# EAGLE design Iridium_Mini_Radio_Beacon (EAGLE 9.4.1)

## Sheet 1 of 5
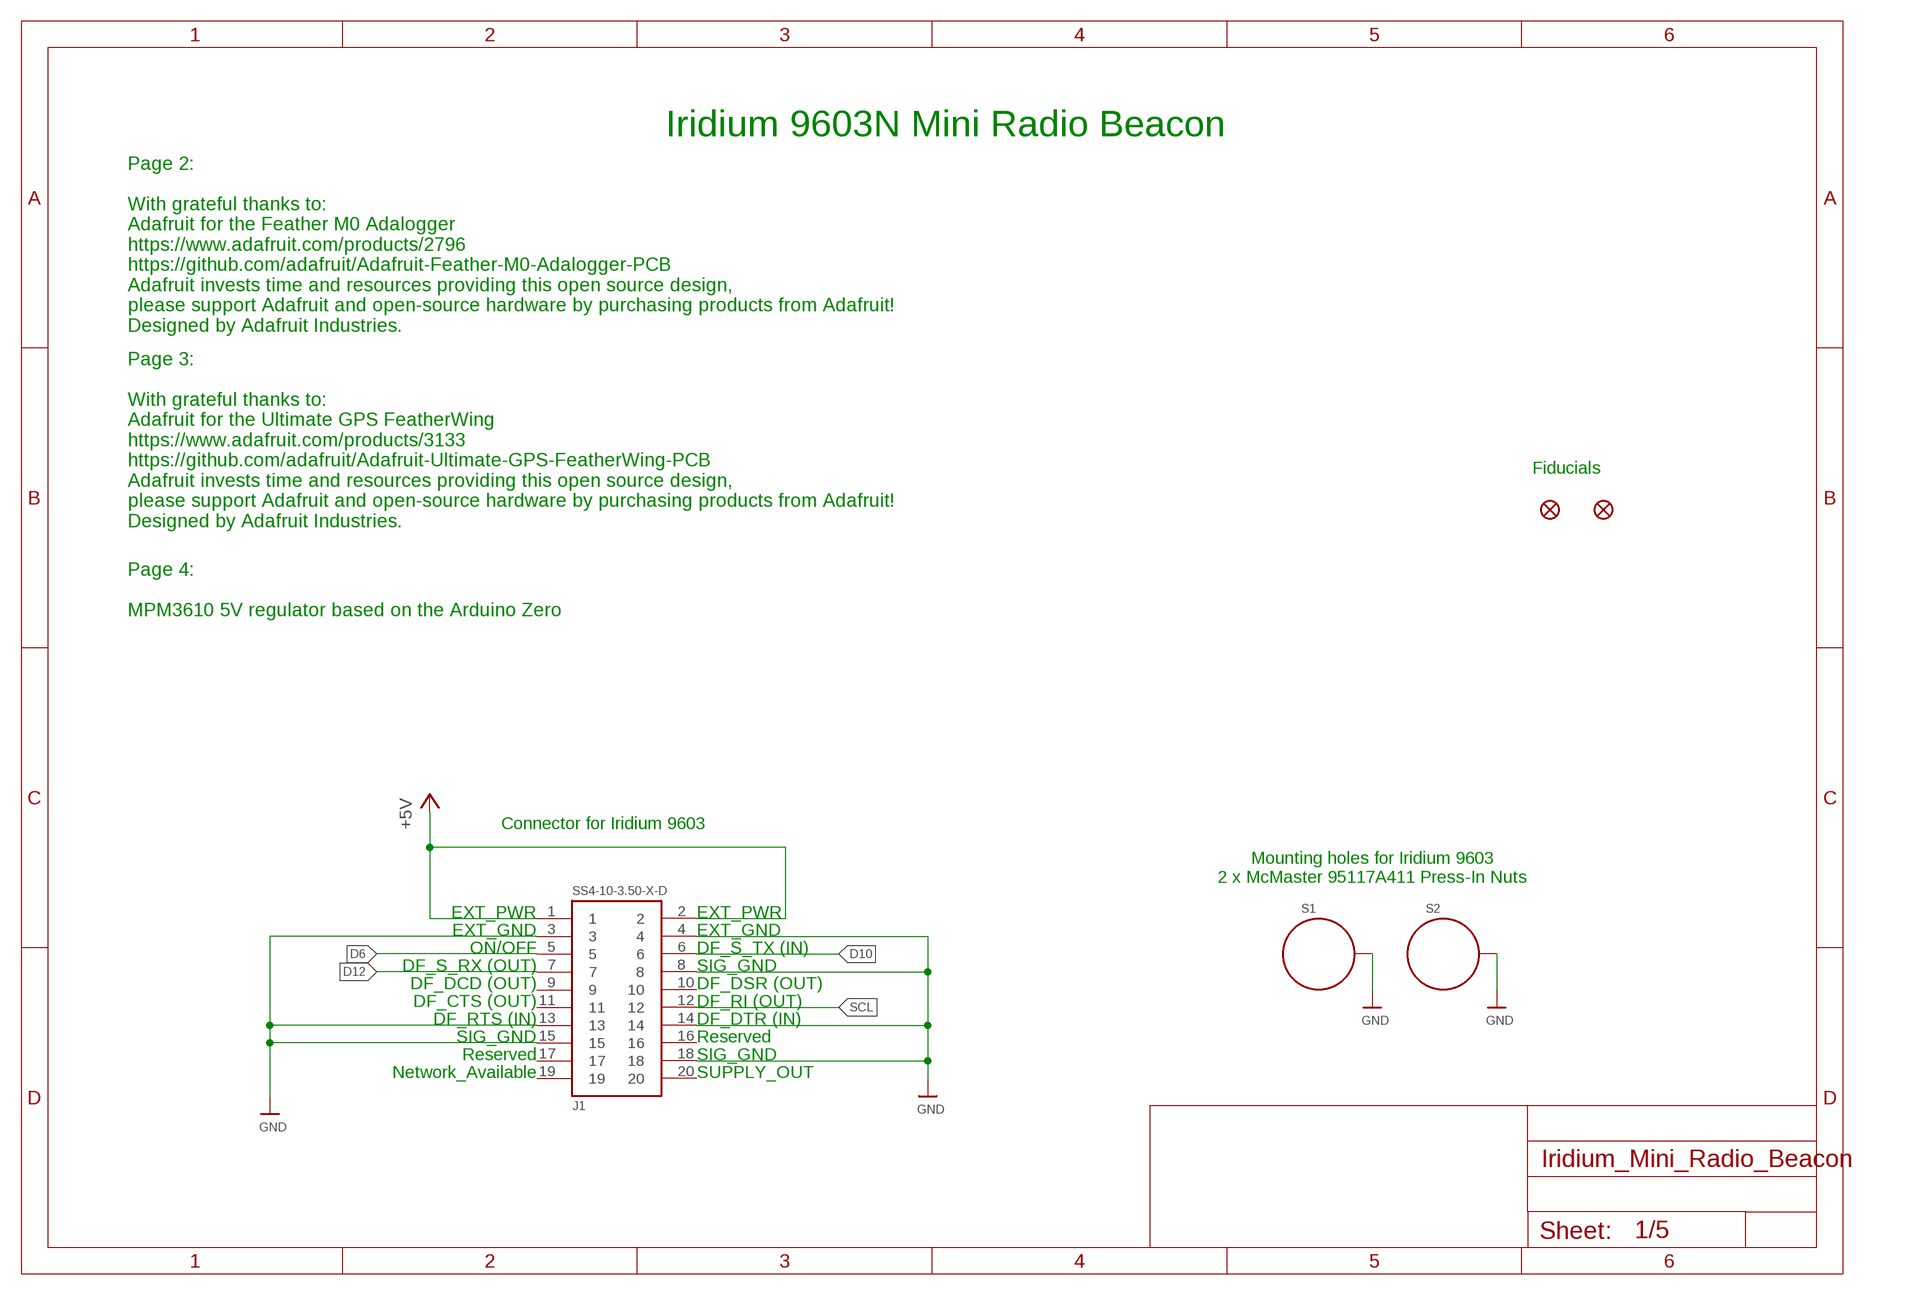
[diagram p0: schematic, sheet 1]

### Parts
FD1  FIDUCIAL1X2  [FIDUCIAL-1X2]
FD2  FIDUCIAL1X2  [FIDUCIAL-1X2]
J1  SS4-10-3.50-X-D  [SS4-10-3.50-X-D]
S1  STANDOFF_ELECTRICALMCMASTER-95117A411  [STANDOFF-ELECTRICAL-MCMASTER-95117A411]
S2  STANDOFF_ELECTRICALMCMASTER-95117A411  [STANDOFF-ELECTRICAL-MCMASTER-95117A411]

### Nets
+5V: J1.1 J1.2 ; also sheet 3,4
D6: J1.5 ; also sheet 2
D10: J1.6 ; also sheet 2
D12: J1.7 ; also sheet 2
GND: J1.3 J1.4 J1.8 J1.13 J1.14 J1.15 J1.18 S1.P1 S2.P1 ; also sheet 2,3,4,5
SCL: J1.12 ; also sheet 2
Unconnected: J1.9 J1.10 J1.11 J1.16 J1.17 J1.19 J1.20

### Notes on the sheet
- Iridium 9603N Mini Radio Beacon
- Page 2:
  
  With grateful thanks to:
  Adafruit for the Feather M0 Adalogger
  https://www.adafruit.com/products/2796
  https://github.com/adafruit/Adafruit-Feather-M0-Adalogger-PCB
  Adafruit invests time and resources providing this open source design,
  please support Adafruit and open-source hardware by purchasing products from Adafruit!
  Designed by Adafruit Industries.
- Fiducials
- Page 3:
  
  With grateful thanks to:
  Adafruit for the Ultimate GPS FeatherWing
  https://www.adafruit.com/products/3133
  https://github.com/adafruit/Adafruit-Ultimate-GPS-FeatherWing-PCB
  Adafruit invests time and resources providing this open source design,
  please support Adafruit and open-source hardware by purchasing products from Adafruit!
  Designed by Adafruit Industries.
- Page 4:
  
  MPM3610 5V regulator based on the Arduino Zero
- Connector for Iridium 9603
- Mounting holes for Iridium 9603
  2 x McMaster 95117A411 Press-In Nuts
- EXT_PWR | EXT_PWR
- EXT_GND | EXT_GND
- ON/OFF | DF_S_TX (IN)
- DF_S_RX (OUT) | SIG_GND
- DF_DCD (OUT) | DF_DSR (OUT)
- DF_CTS (OUT) | DF_RI (OUT)
- DF_RTS (IN) | DF_DTR (IN)
- SIG_GND | Reserved
- Reserved | SIG_GND
- Network_Available | SUPPLY_OUT

## Sheet 2 of 5
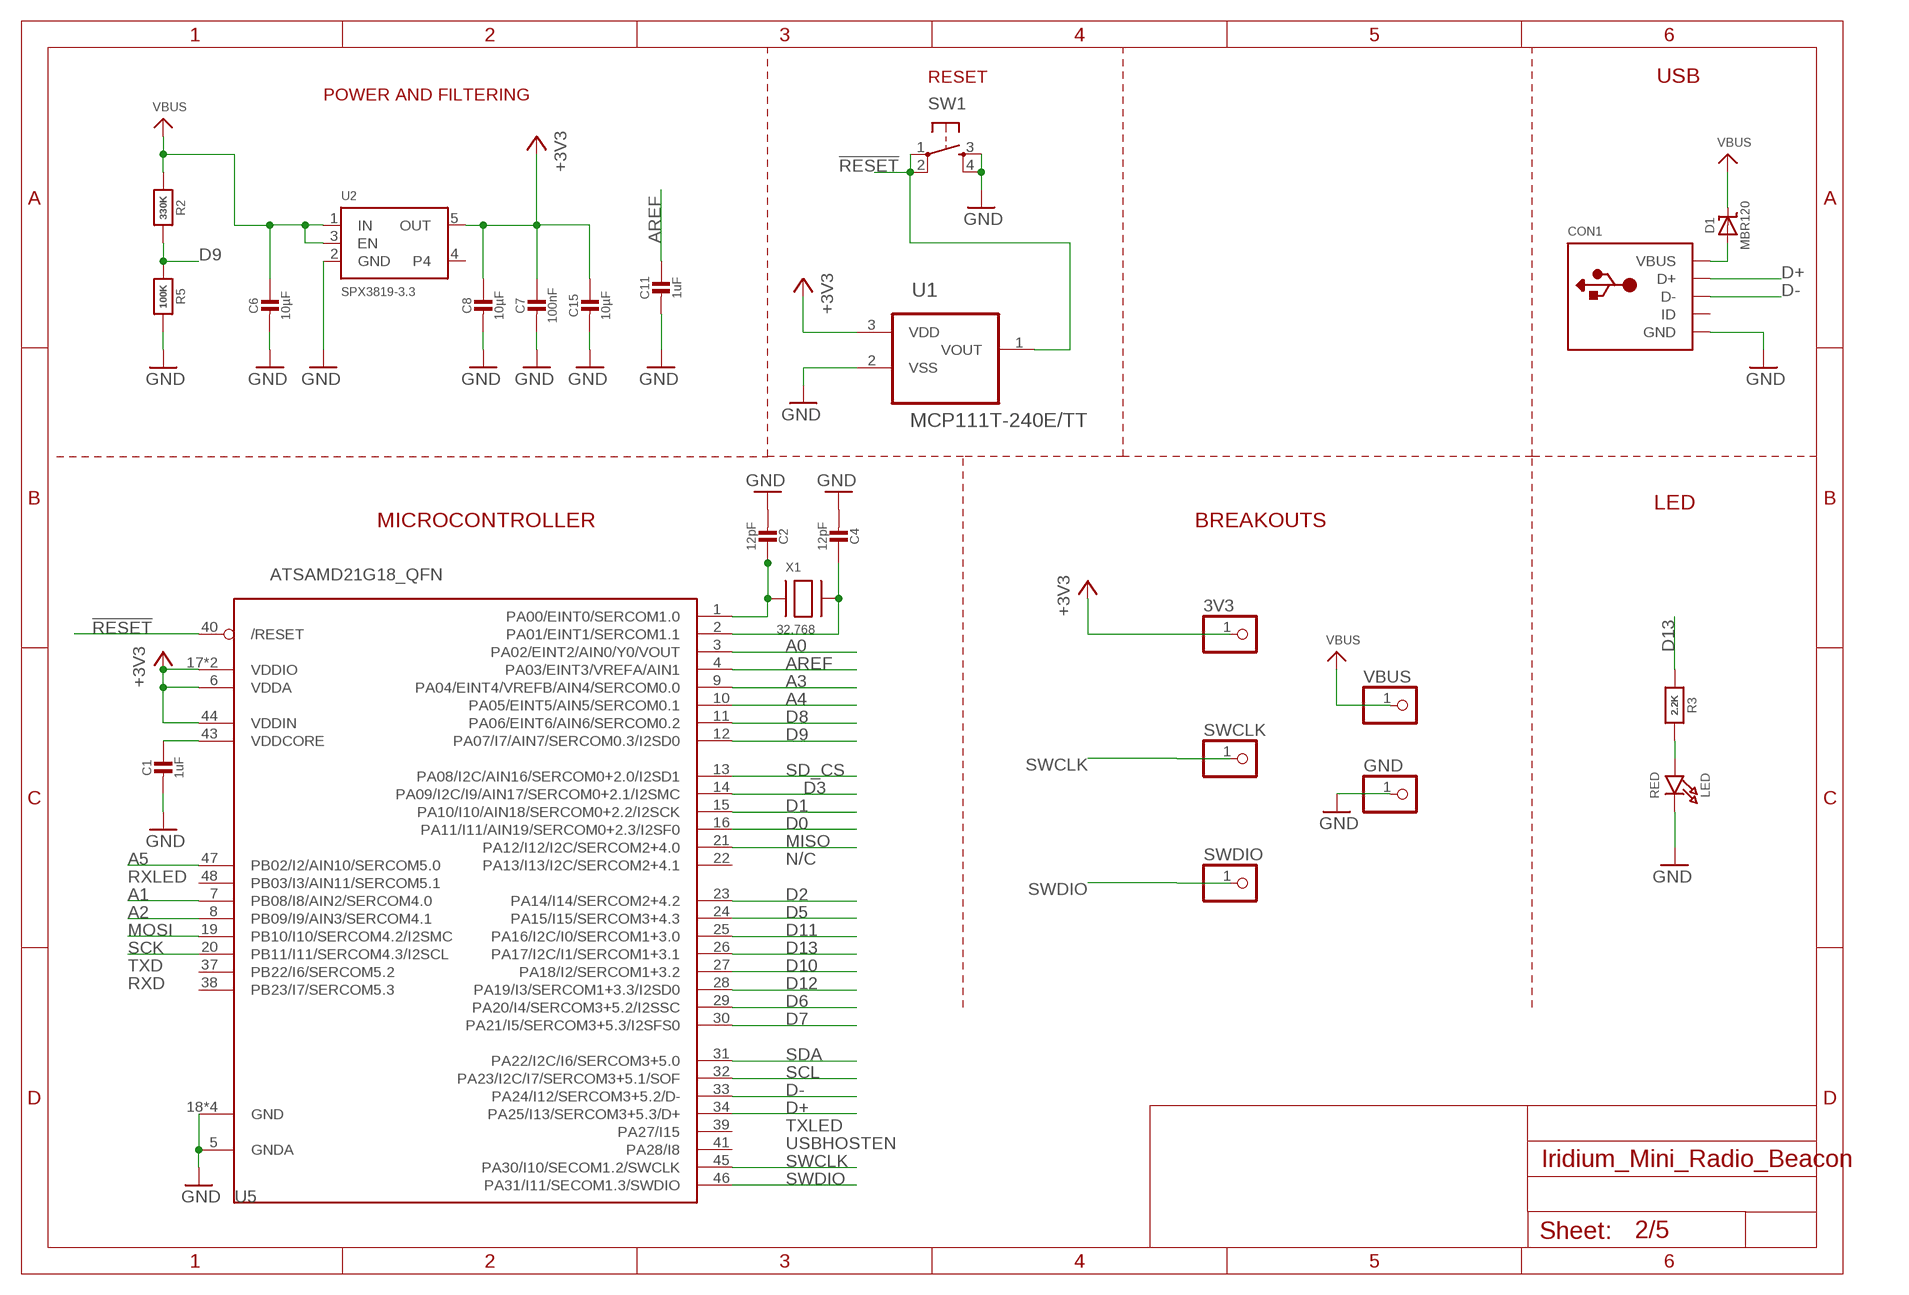
[diagram p1: schematic, sheet 2]

### Parts
3V3  PINHD-1X1  [1X01]
C1  1uF  CAP_CERAMIC0603_NO  [0603-NO]
C2  12pF  CAP_CERAMIC0603_NO  [0603-NO]
C4  12pF  CAP_CERAMIC0603_NO  [0603-NO]
C6  10µF  CAP_CERAMIC0805-NOOUTLINE  [0805-NO]
C7  100nF  CAP_CERAMIC0603_NO  [0603-NO]
C8  10µF  CAP_CERAMIC0805-NOOUTLINE  [0805-NO]
C11  1uF  CAP_CERAMIC0603_NO  [0603-NO]
C15  10µF  CAP_CERAMIC0805-NOOUTLINE  [0805-NO]
CON1  MICROBUILDER_USBFCI_10103594_CORRECTED  [MICROBUILDER_FCI_10103594_CORRECTED]
D1  MBR120  DIODE-SCHOTTKYSOD-123  [SOD-123]
GND  PINHD-1X1  [1X01]
LED  RED  LED0805_NOOUTLINE  [CHIPLED_0805_NOOUTLINE]
R2  330K  RESISTOR_0603_NOOUT  [0603-NO]
R3  2.2K  RESISTOR_0603_NOOUT  [0603-NO]
R5  100K  RESISTOR_0603_NOOUT  [0603-NO]
SW1  SWITCH_SPST_4_PINRECT  [TACTILE_SWITCH_SMD_4.6X2.8MM]
SWCLK  PINHD-1X1  [1X01]
SWDIO  PINHD-1X1  [1X01]
U1  MCP111T-240E/TT  MCP111T-270E/TT  [SOT95P237X112-3N]
U2  SPX3819-3.3  VREG_SOT23-5  [SOT23-5]
U5  ATSAMD21G18_QFN  ATSAMD21J_QFN  [TQFN48_7MM]
VBUS  PINHD-1X1  [1X01]
X1  32.768  XTAL-3.2X1.5  [XTAL3215]

### Nets
!RESET: SW1.1 SW1.2 U1.1(VOUT) U5.40(/RESET) ; also sheet 5
+3V3: 3V3.1 C7.1 C8.1 C15.1 U1.3(VDD) U2.5(OUT) U5.6(VDDA) U5.17(VDDIO) U5.36(VDDIO) U5.44(VDDIN) ; also sheet 3,5
A0: U5.3(PA02/EINT2/AIN0/Y0/VOUT) ; also sheet 5
A1: U5.7(PB08/I8/AIN2/SERCOM4.0)
A2: U5.8(PB09/I9/AIN3/SERCOM4.1) ; also sheet 5
A3: U5.9(PA04/EINT4/VREFB/AIN4/SERCOM0.0)
A4: U5.10(PA05/EINT5/AIN5/SERCOM0.1)
A5: U5.47(PB02/I2/AIN10/SERCOM5.0)
AREF: C11.1 U5.4(PA03/EINT3/VREFA/AIN1)
D0: U5.16(PA11/I11/AIN19/SERCOM0+2.3/I2SF0) ; also sheet 3
D1: U5.15(PA10/I10/AIN18/SERCOM0+2.2/I2SCK) ; also sheet 3
D2: U5.23(PA14/I14/SERCOM2+4.2)
D3: U5.14(PA09/I2C/I9/AIN17/SERCOM0+2.1/I2SMC)
D5: U5.24(PA15/I15/SERCOM3+4.3) ; also sheet 4
D6: U5.29(PA20/I4/SERCOM3+5.2/I2SSC) ; also sheet 1
D7: U5.30(PA21/I5/SERCOM3+5.3/I2SFS0)
D8: U5.11(PA06/EINT6/AIN6/SERCOM0.2)
D9: R2.2 R5.1 U5.12(PA07/I7/AIN7/SERCOM0.3/I2SD0)
D10: U5.27(PA18/I2/SERCOM1+3.2) ; also sheet 1
D11: U5.25(PA16/I2C/I0/SERCOM1+3.0) ; also sheet 3
D12: U5.28(PA19/I3/SERCOM1+3.3/I2SD0) ; also sheet 1
D13: R3.1 U5.26(PA17/I2C/I1/SERCOM1+3.1)
D+: CON1.D+ U5.34(PA25/I13/SERCOM3+5.3/D+)
D-: CON1.D- U5.33(PA24/I12/SERCOM3+5.2/D-)
GND: C1.2 C2.2 C4.2 C6.2 C7.2 C8.2 C11.2 C15.2 CON1.BASE@1(GND) CON1.BASE@2(GND) CON1.GND CON1.SPRT@1(GND) CON1.SPRT@2(GND) CON1.SPRT@3(GND) CON1.SPRT@4(GND) GND.1 LED.C R5.2 SW1.3 SW1.4 U1.2(VSS) U2.2(GND) U5.5(GNDA) U5.18(GND) U5.35(GND) U5.42(GND) U5.THERMAL(GND) ; also sheet 1,3,4,5
MISO: U5.21(PA12/I12/I2C/SERCOM2+4.0)
MOSI: U5.19(PB10/I10/SERCOM4.2/I2SMC) ; also sheet 5
N$3: LED.A R3.2
N$5: C2.1 U5.1(PA00/EINT0/SERCOM1.0) X1.P$1
N$7: C4.1 U5.2(PA01/EINT1/SERCOM1.1) X1.P$2
N$16: CON1.VBUS D1.A
SCK: U5.20(PB11/I11/SERCOM4.3/I2SCL) ; also sheet 5
SCL: U5.32(PA23/I2C/I7/SERCOM3+5.1/SOF) ; also sheet 1
SD_CS: U5.13(PA08/I2C/AIN16/SERCOM0+2.0/I2SD1)
SDA: U5.31(PA22/I2C/I6/SERCOM3+5.0)
SWCLK: SWCLK.1 U5.45(PA30/I10/SECOM1.2/SWCLK)
SWDIO: SWDIO.1 U5.46(PA31/I11/SECOM1.3/SWDIO)
VBUS: C6.1 D1.C R2.1 U2.1(IN) U2.3(EN) VBUS.1 ; also sheet 4
VDDCORE1: C1.1 U5.43(VDDCORE)
Unconnected: CON1.ID U2.4 U5.22(PA13/I13/I2C/SERCOM2+4.1) U5.37(PB22/I6/SERCOM5.2) U5.38(PB23/I7/SERCOM5.3) U5.39(PA27/I15) U5.41(PA28/I8) U5.48(PB03/I3/AIN11/SERCOM5.1)

### Notes on the sheet
- RESET | USB
- POWER AND FILTERING
- LED
- MICROCONTROLLER | BREAKOUTS
- N/C
- RXLED
- TXD
- RXD
- TXLED
- USBHOSTEN

## Sheet 3 of 5
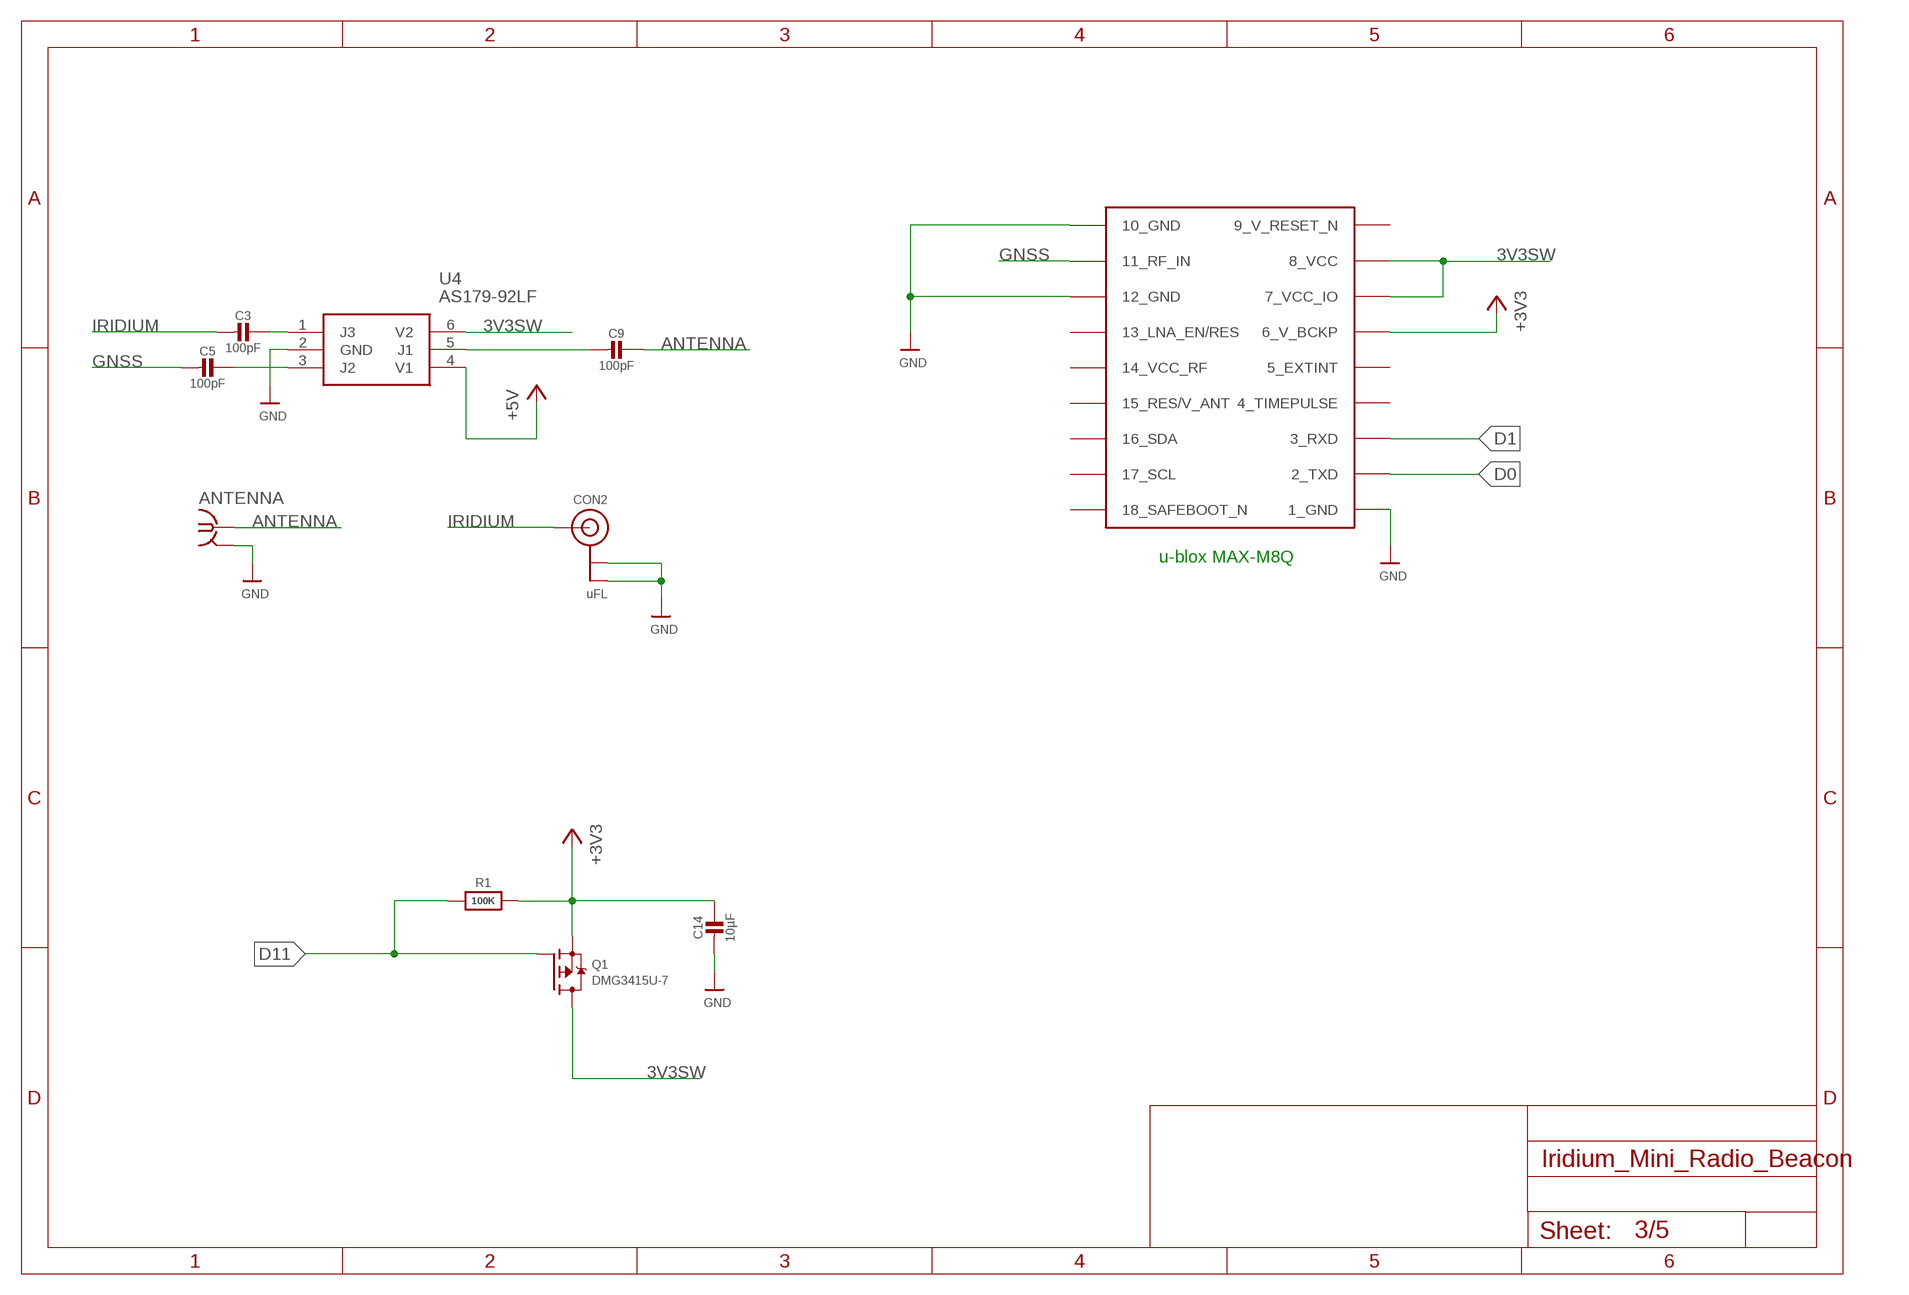
[diagram p2: schematic, sheet 3]

### Parts
ANTENNA  SMA-142-0711-821/826  [J502-ND-142-0711-821/826]
C3  100pF  CAP_CERAMIC0603_NO  [0603-NO]
C5  100pF  CAP_CERAMIC0603_NO  [0603-NO]
C9  100pF  CAP_CERAMIC0603_NO  [0603-NO]
C14  10µF  CAP_CERAMIC0805-NOOUTLINE  [0805-NO]
CON2  uFL  ANTENNA_U.FL  [U.FL]
Q1  DMG3415U-7  MOSFET-PWIDE  [SOT23-WIDE]
R1  100K  RESISTOR_0603_NOOUT  [0603-NO]
U3  MAX-M8  [MAX-M8]
U4  AS179-92LF  [SOT65P220X100-6N]

### Nets
3V3SW: Q1.3(D) U3.7_VCC_IO U3.8_VCC U4.6(V2)
+3V3: C14.1 Q1.2(S) R1.2 U3.6_V_BCKP ; also sheet 2,5
+5V: U4.4(V1) ; also sheet 1,4
ANTENNA: ANTENNA.1 C9.1
D0: U3.2_TXD ; also sheet 2
D1: U3.3_RXD ; also sheet 2
D11: Q1.1(G) R1.1 ; also sheet 2
GND: ANTENNA.G@1 ANTENNA.G@2 ANTENNA.G@3 ANTENNA.G@4 C14.2 CON2.1(GND) CON2.2(GND) U3.1_GND U3.10_GND U3.12_GND U4.2(GND) ; also sheet 1,2,4,5
GNSS: C5.2 U3.11_RF_IN
IRIDIUM: C3.2 CON2.3(SIGNAL)
N$1: C3.1 U4.1(J3)
N$2: C5.1 U4.3(J2)
N$4: C9.2 U4.5(J1)
Unconnected: U3.4_TIMEPULSE U3.5_EXTINT U3.13_LNA_EN(13_LNA_EN/RES) U3.14_VCC_RF U3.15_V_ANT/RESERVED(15_RES/V_ANT) U3.16_SDA U3.17_SCL U3.18_SAFEBOOT_N

### Notes on the sheet
- u-blox MAX-M8Q

## Sheet 4 of 5
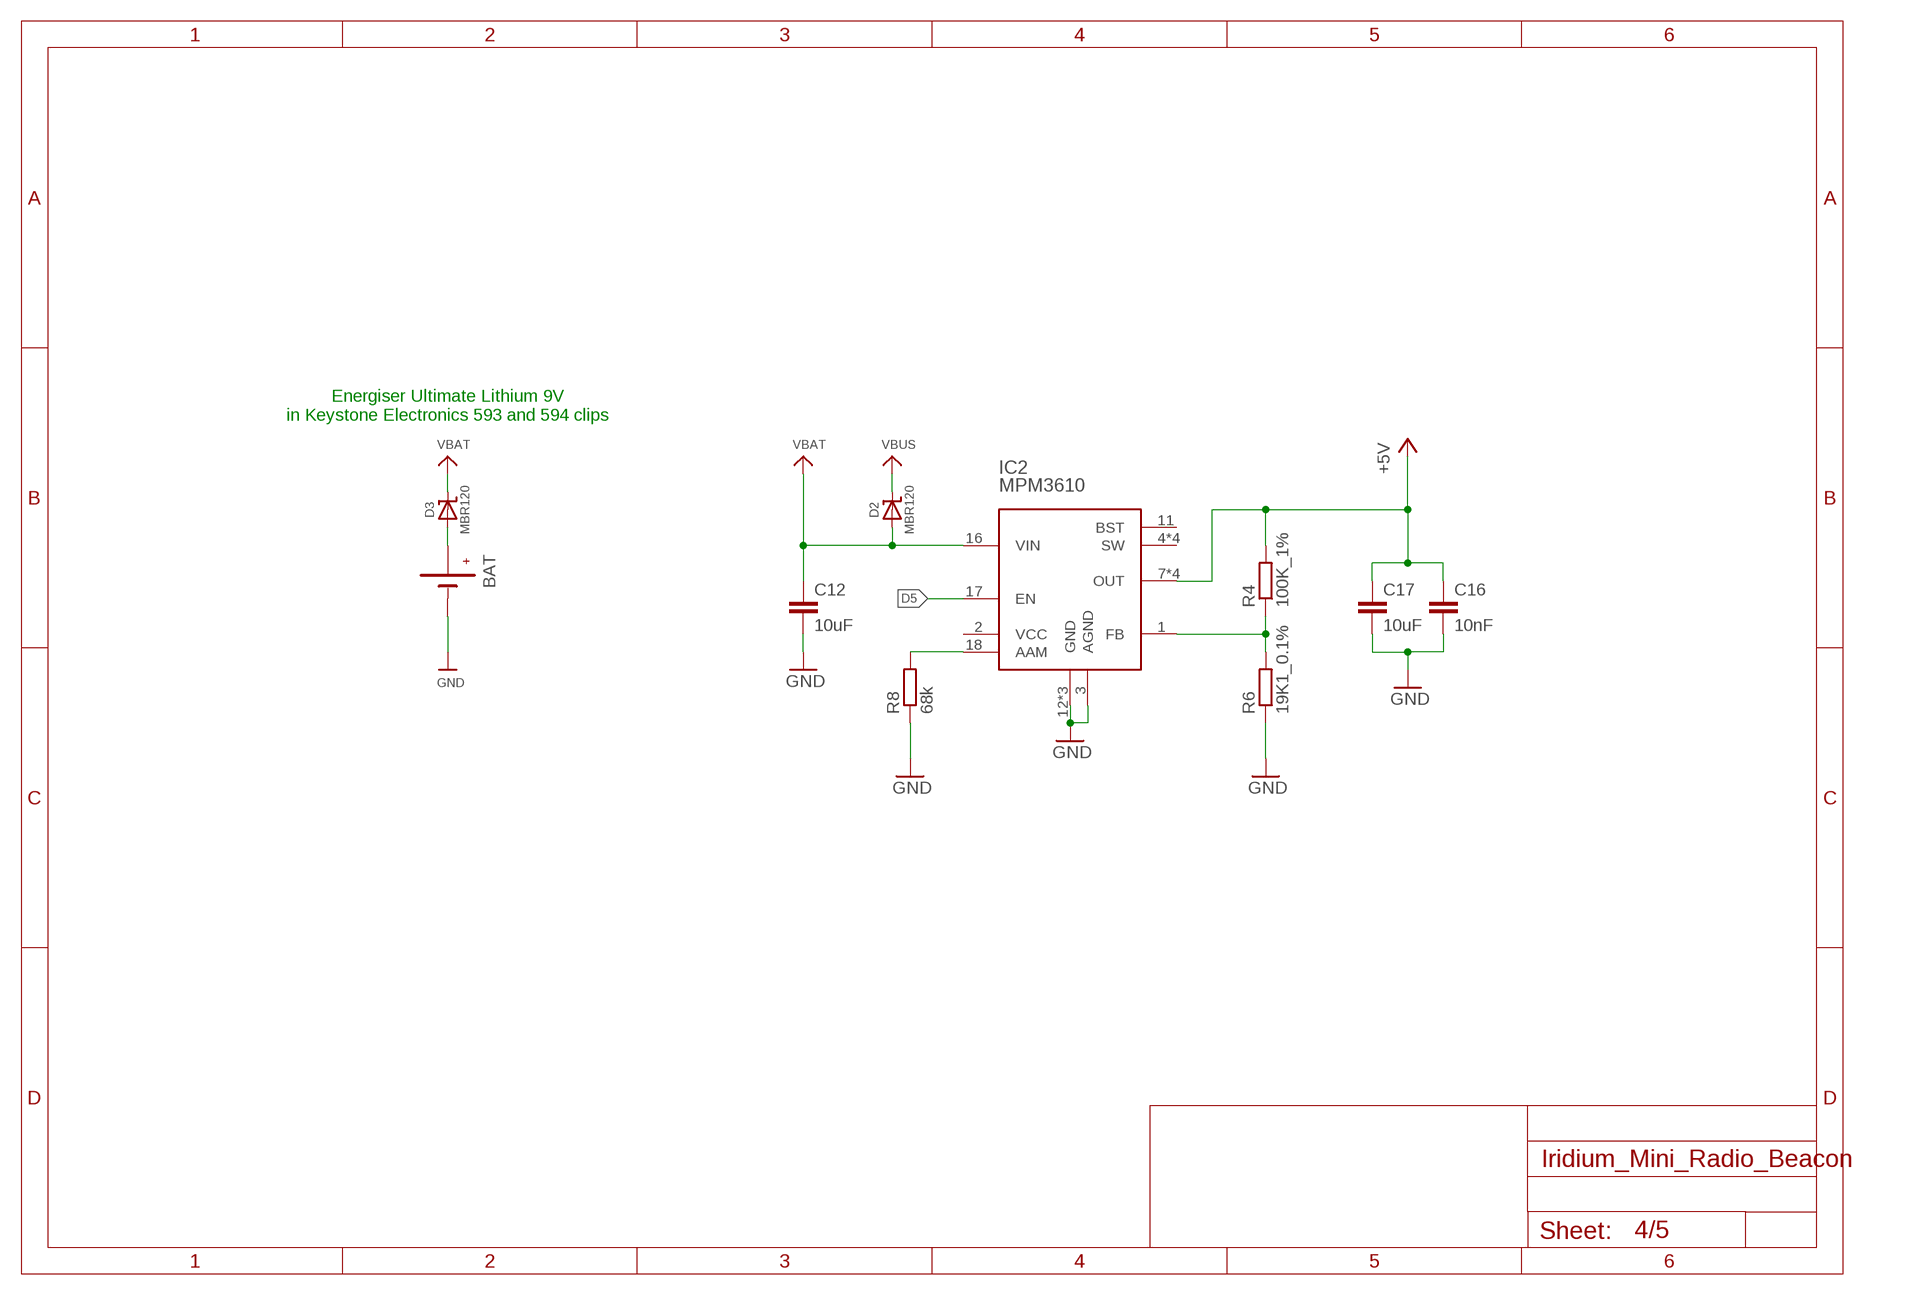
[diagram p3: schematic, sheet 4]

### Parts
BAT  BATTERYBATTERY-9V-KEYSTONE-593-594-FLIPPED  [BATTERY-9V-KEYSTONE-593-594-FLIPPED]
C12  10uF  C-EUC0805  [C0805]
C16  10nF  C-EUC0805  [C0805]
C17  10uF  C-EUC0805  [C0805]
D2  MBR120  DIODE-SCHOTTKYSOD-123  [SOD-123]
D3  MBR120  DIODE-SCHOTTKYSOD-123  [SOD-123]
IC2  MPM3610  2093_MPM3610GQV-P  [QFN-20]
R4  100K_1%  R-EU_R0603  [R0603]
R6  19K1_0.1%  R-EU_R0603  [R0603]
R8  68k  R-EU_R0603  [R0603]

### Nets
+5V: C16.1 C17.1 IC2.7(OUT) IC2.8(OUT) IC2.9(OUT) IC2.20(OUT) R4.2 ; also sheet 1,3
D5: IC2.17(EN) ; also sheet 2
GND: BAT.GND1(-) BAT.GND2(-) BAT.GND(-) C12.2 C16.2 C17.2 IC2.3(AGND) IC2.12(GND) IC2.13(GND) IC2.14(GND) R6.1 R8.1 ; also sheet 1,2,3,5
N$8: BAT.PWR1(+) BAT.PWR2(+) BAT.PWR(+) D3.A
N$26: IC2.1(FB) R4.1 R6.2
N$29: IC2.18(AAM) R8.2
VBAT: C12.1 D2.A D3.C IC2.16(VIN)
VBUS: D2.C ; also sheet 2
Unconnected: IC2.2(VCC) IC2.4(SW) IC2.5(SW) IC2.6(SW) IC2.11(BST) IC2.19(SW)

### Notes on the sheet
- Energiser Ultimate Lithium 9V
  in Keystone Electronics 593 and 594 clips

## Sheet 5 of 5
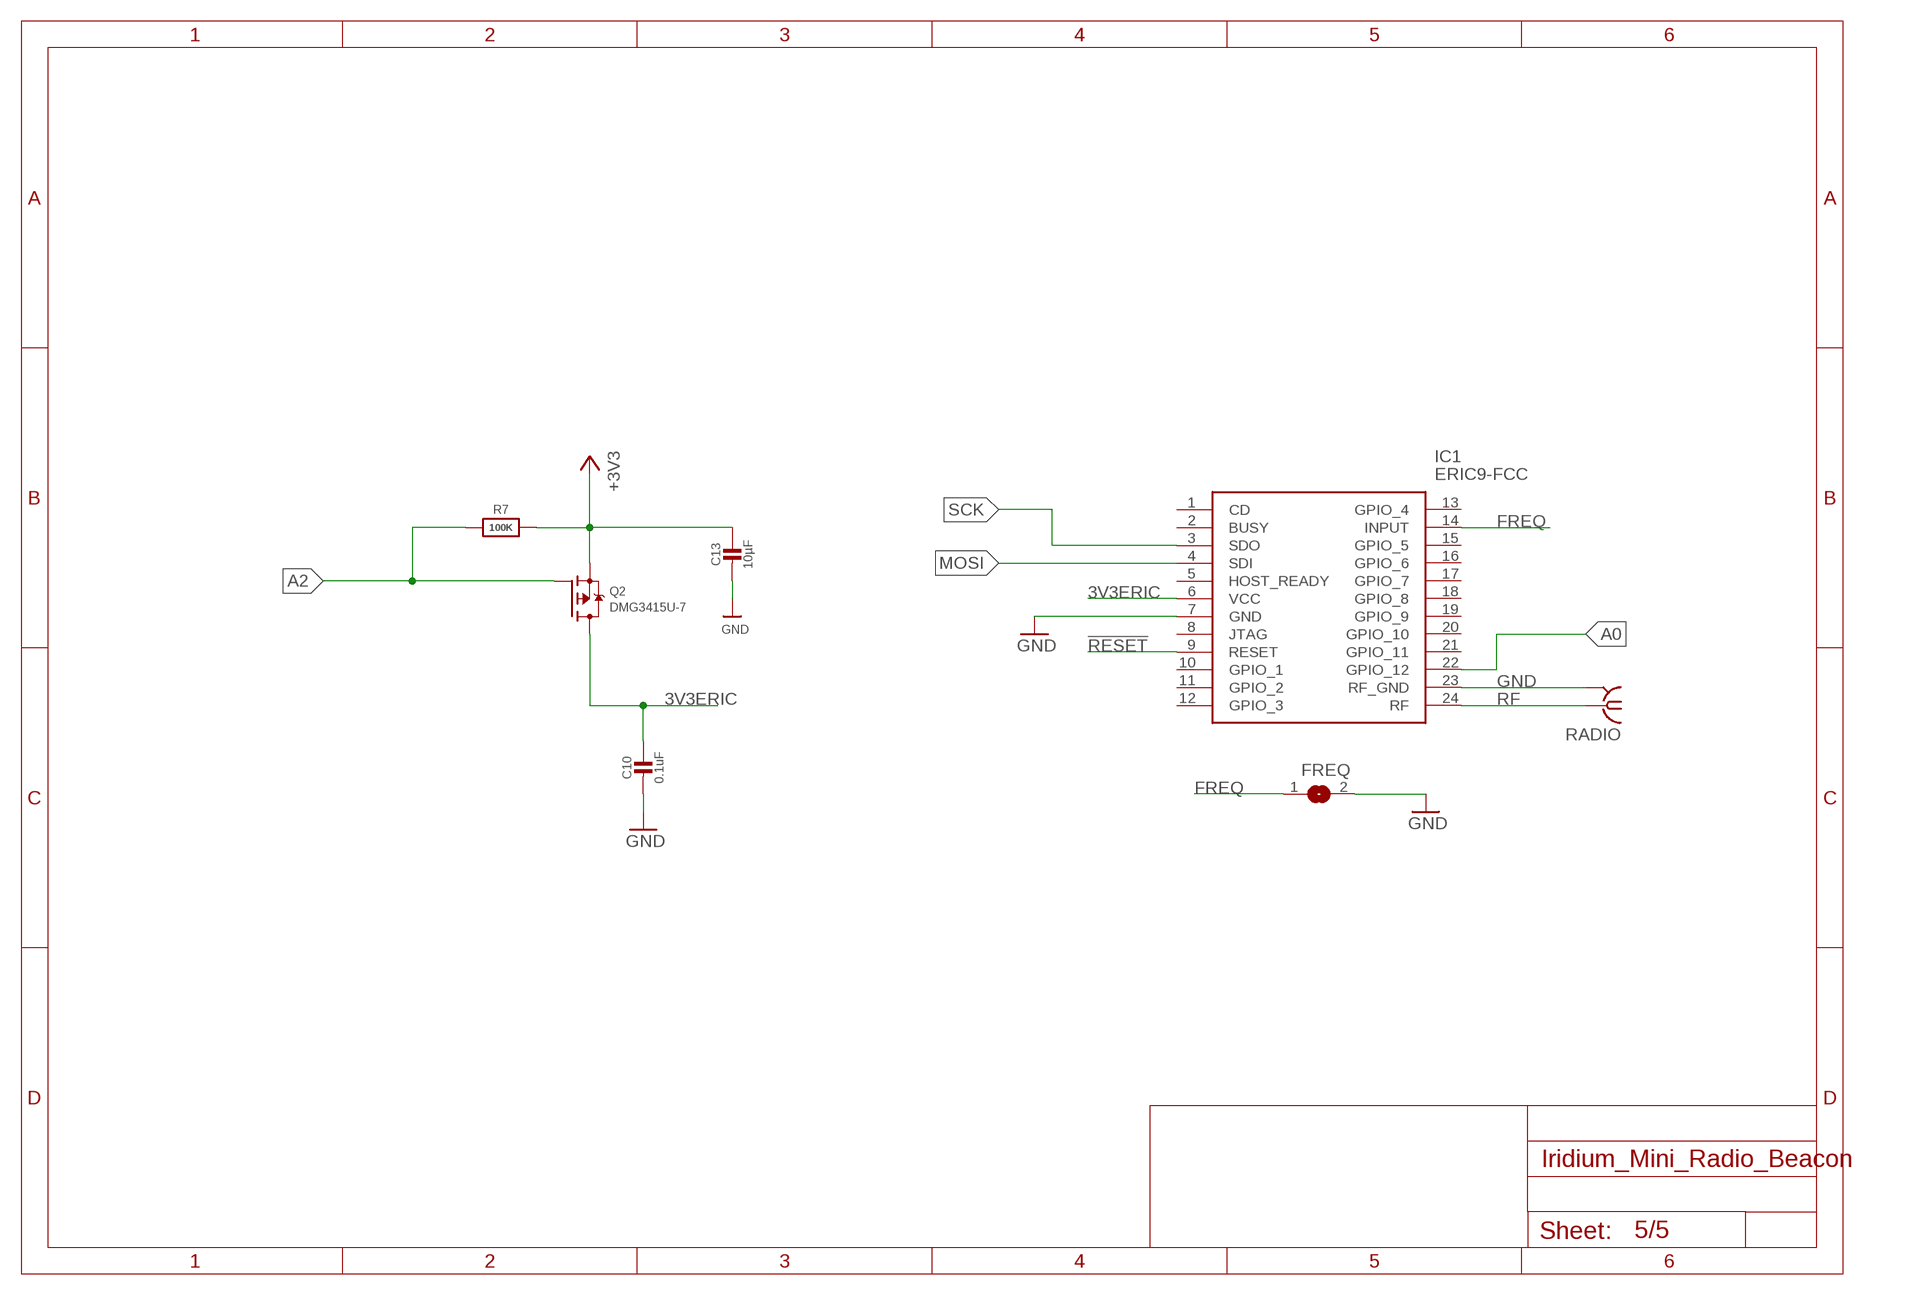
[diagram p4: schematic, sheet 5]

### Parts
C10  0.1uF  CAP_CERAMIC0603_NO  [0603-NO]
C13  10µF  CAP_CERAMIC0805-NOOUTLINE  [0805-NO]
FREQ  SOLDERJUMPER  [SOLDERJUMPER_ARROW_NOPASTE]
IC1  ERIC9-FCC  [ERIC4]
Q2  DMG3415U-7  MOSFET-PWIDE  [SOT23-WIDE]
R7  100K  RESISTOR_0603_NOOUT  [0603-NO]
RADIO  SMA-142-0711-821/826  [J502-ND-142-0711-821/826]

### Nets
3V3ERIC: C10.1 IC1.6(VCC) Q2.3(D)
!RESET: IC1.9(RESET) ; also sheet 2
+3V3: C13.1 Q2.2(S) R7.2 ; also sheet 2,3
A0: IC1.22(GPIO_12) ; also sheet 2
A2: Q2.1(G) R7.1 ; also sheet 2
FREQ: FREQ.1 IC1.14(INPUT)
GND: C10.2 C13.2 FREQ.2 IC1.7(GND) IC1.23(RF_GND) RADIO.G@1 RADIO.G@2 RADIO.G@3 RADIO.G@4 ; also sheet 1,2,3,4
MOSI: IC1.4(SDI) ; also sheet 2
RF: IC1.24(RF) RADIO.1
SCK: IC1.3(SDO) ; also sheet 2
Unconnected: IC1.1(CD) IC1.2(BUSY) IC1.5(HOST_READY) IC1.8(JTAG) IC1.10(GPIO_1) IC1.11(GPIO_2) IC1.12(GPIO_3) IC1.13(GPIO_4) IC1.15(GPIO_5) IC1.16(GPIO_6) IC1.17(GPIO_7) IC1.18(GPIO_8) IC1.19(GPIO_9) IC1.20(GPIO_10) IC1.21(GPIO_11)

## Power pins joined to a net without a drawn wire
9_V_RESET_N: U3.9_RESET_N(9_V_RESET_N)

## Library data of the parts
3V3 GND SWCLK SWDIO VBUS = adafruit:PINHD-1X1: Pin header 1x1 for 0.1" spacing With round pins
ANTENNA RADIO = con-coax:SMA-: SMA 50 Ohm End Launch Jack Receptacle - Round Contact Johnson Components Source: www.johnsoncomponents.com .. J502-ND.pdf; MF: JOHNSON COMPONENTS; MPN: 142-0711-821; OC_FARNELL: 1019328; OC_NEWARK: 16F3627
BAT = SparkFun-Electromechanical:BATTERY: Battery Holders Various common sizes : AA, AAA, 18650 (PRT-12895), 20mm coin cell and 12mm coin cell. 20MM_4LEGS, BATT-10373
C1-C11 C13-C15 = microbuilder:CAP_CERAMIC: Ceramic Capacitors For new designs, use the packages preceded by an '_' character since they are more reliable: The following footprints should be used on most boards: _0402 - Standard footprint for regular board layouts _0603 - Standard footprint for regular board layouts _0805 - Standard footprint for regular board layouts _1206 - Standard footprint for regular board layouts For extremely tight-pitch boards where space is at a premium, the following 'micro-pitch' footprints can be used (smaller pads, no silkscreen outline, etc.): _0402MP - Micro-pitch footprint for very dense/compact boards _0603MP - Micro-pitch footprint for very dense/compact boards _0805MP - Micro-pitch footprint for very dense/compact boards _1206MP - Micro-pitch footprint for very dense/compact boards
C12 C16 C17 = rcl:C-EU: CAPACITOR, European symbol; SPICEPREFIX: C
CON1 = Iridium_9603_Beacon:MICROBUILDER_USB: USB Connectors USBMINIB - Surface Mount Female Mini-B USB Connector 4UConnector: 06564
CON2 = microbuilder:ANTENNA_U.FL: U.FL Antenna Connector
D1-D3 = microbuilder:DIODE-SCHOTTKY
FD1 FD2 = SparkFun-Aesthetics:FIDUCIAL: Fiducial Alignment Points Various fiducial points for machine vision alignment.
FREQ = microbuilder:SOLDERJUMPER: SMD Solder JUMPER Solder the two pads together to create a connection, or remove the solder to break it. REFLOW - Use this footprint for solder paste and reflow ovens. WAVE - Use this footprint for hand-soldering (larger pads). CLOSED - Has a trace between the two pads to ensure it is closed by default. The trace needs to be cut to disable the jumper, and can be closed again by creating a solder bridge between the two pads.; BOM: EXCLUDE
IC1 = SamacSys_Parts:ERIC9-FCC: RF Modules Euro/US 868/915MHz Int Cont Trans RFMod Source: Datasheet <https://componentsearchengine.com/Datasheets/1/eRIC9-FCC.pdf>; ARROW_PART_NUMBER: eRIC9-FCC; DESCRIPTION: RF Modules Euro/US 868/915MHz Int Cont Trans RFMod; HEIGHT: mm; MANUFACTURER_NAME: LPRS; MANUFACTURER_PART_NUMBER: eRIC9-FCC
IC2 = IntegratedCircuits:2093_MPM3610GQV-P: MPM3610 Step Down Regulator; CASE: QFN-20; PART_NUMBER: MPM3610GQV-P; TYPE: Circuito_Integrato
J1 = SS4-10-3.50-X-D:SS4-10-3.50-X-D: 0.4mm[.016] SOCKET STRIP ASSEMBLY.
LED = microbuilder:LED: LED 0603 - 0603 Surface Mount Package 2mA: Green LED - Low Power (3.9mcd, 2ma, 1.7Vf) - Digikey: 475-2709-2-ND Orange LED - Low Power (9.8mcd, 2ma, 1.8Vf) - Digikey: 475-1194-2-ND Red LED - Low Power (5mcd, 2ma, 1.8Vf) - Digikey: 475-1195-2-ND Yellow LED - Low Power (7mcd, 2ma, 1.8Vf) - Digikey: 475-1196-2-ND 5mA: Blue LED - Low Power (17mcd, 5ma, 2.9Vf) - Digikey: LNJ937W8CRACT-ND 0805 - 0805 Surface Mount Package 2mA: Red LED (8.8mcd, 2mA, 1.8Vf, Clear) - Low Power [Digikey: 475-2510-1-ND] Green LED (5mcd, 2mA, 1.8Vf, Clear) - Low Power [Digikey: 475-2730-1-ND] Yellow LED (11.3mcd, 2mA, 1.8Vf, Clear) - Low Power [Digikey: 475-2555-1-ND] 20mA: Red LED (104mcd, 20mA, Diffused) - LS R976 [Digikey: 475-1278-6-ND] Red LED (12mcd, 20mA, 2.0Vf, Clear) - APT2012EC [Digikey: 754-1128-1-ND] Green LED (15mcd, 20mA, 2.2Vf, Clear) - APT2012GC [Digikey: 754-1131-1-ND] Orange LED (160mcd, 20mA, 2.1Vf, Clear) - APT2012SECK [Digikey: 754-1130-1-ND] 1206 - 1206 Surface Mount Package Green LED (26mcd, 20mA, Diffused) - LG N971 [Digikey: 475-1407-6-ND] Red LED (15mcd, 20mA, Diffused) - LH N974 [Digikey: 475-1416-6-ND] Cree - Cree High-Power Surface Mount LEDs XPEBWT-L1-0000-00D50 - White 111lm 350mA 2.9Vf 6200K 110° XTEAWT-00-0000-00000LEE3 - White 114lm 350mA 2.85Vf 5000K 115° Everlight - Everlight 45-21 Series Surface Mount LEDs 45-21/QK2C-B2832AC2CB2/2T - Warm White 2000mcd 20mA 3.25Vf 3050K 120° 45-21/LK2C-B38452C4CB2/2T - Nuetral White 2000mcd 20mA 3.25Vf 4150K 120° 45-21/LK2C-B50634C6CB2/2T - Cold White 2200mcd 20mA 3.25Vf 5650K 120° PLCC2 Reverse Mount LS T77K-J1L2-1-0-2-R18-Z - Red 11.25mcd 2mA 1.8Vf 630nm 120° LO T77K-L1M2-24-Z - Orange 19.6mcd 2mA 1.8Vf 606nm 120° LY T77K-K2M1-26-Z - Yellow 15.7mcd 2mA 1.8Vf 587nm 120°
Q1 Q2 = microbuilder:MOSFET-P: P-Channel Mosfet LEGEND VDS: Voltage Drain-Source ID: Drain Current RDS(ON): Drain-Source On-State Resistance VGS(TH): Gate-Source Threshold Voltage CISS: Drain-Source Input Capacitance SOT-23 Name VDS ID RDS(ON) VGS(TH) CISS Order Number IRLML5103 30V 760mA 600 mOhm -- 75pF @ 25V Digikey: IRLML5103PBFCT-ND IRLML6401 12V 4.3A 50 mOhm 950mV @ 250µA 830pF @ 10V Digikey: IRLML6401PBFTR-ND NTR0202PL 20V 400mA 800 mOhm 2.3V @ 250uA 70pF @ 5V Digikey: NTR0202PLT1GOSTR-ND NTR4101PT1G 20V 1.8A 85 mOhm 1.2V @ 250uA 675pF @ 10V Digikey: NTR4101PT1GOSCT-ND DMP2004K 20V 600mA 900 mOhm 1V @ 250uA 175pF @ 16V Digikey: DMP2004KDICT-ND PMV65XP 20V 3.9A 76 mOhm 950mV @ 1mA 725pF @ 20V Digikey: 568-2358-2-ND TO-252 Name VDS ID RDS(ON) VGS(TH) CISS Order Number AOD417 30V 25A 34 mOhm 3V @ 250µA 920pF @ 15V Digikey: 785-1106-2-ND
R1-R3 R5 R7 = microbuilder:RESISTOR: Resistors For new designs, use the packages preceded by an '_' character since they are more reliable: The following footprints should be used on most boards: _0402 - Standard footprint for regular board layouts _0603 - Standard footprint for regular board layouts _0805 - Standard footprint for regular board layouts _1206 - Standard footprint for regular board layouts For extremely tight-pitch boards where space is at a premium, the following 'micro-pitch' footprints can be used (smaller pads, no silkscreen outline, etc.): _0402MP - Micro-pitch footprint for very dense/compact boards _0603MP - Micro-pitch footprint for very dense/compact boards _0805MP - Micro-pitch footprint for very dense/compact boards _1206MP - Micro-pitch footprint for very dense/compact boards
R4 R6 R8 = rcl:R-EU_: RESISTOR, European symbol; SPICEPREFIX: R
S1 S2 = SparkFun-Electromechanical:STANDOFF_ELECTRICAL: A standoff intended to be an electrically connected point.
SW1 = SparkFun-Electromechanical:SWITCH_SPST_4_PIN; PROD_ID: SWCH-13065
U1 = Microchip-MCP11:MCP11: Micropower Voltage Detector ,SOT23-3;; MPN: MCP111T-240E/TT; OC_FARNELL: 1851877; OC_NEWARK: 56J7328; PACKAGE: SOT23-3; SUPPLIER: MICROCHIP
U2 = microbuilder:VREG_SOT23-5: SOT23-5 Fixed Voltage Regulators Part Current Out V Out V In V Dropout θJA (°C/W) TJ (°C) Digikey Part No. ADP121 150mA 3.3V 3.4-5.5V 0.09V @ 150mA -- -- ADP121-AUJZ33R7CT-ND ADP121 150mA 3.0V 3.1-5.5V 0.09V @ 150mA -- -- ADP121-AUJZ30R7CT-ND ADP122 300mA 3.3V 3.4-5.5V 0.085V @ 300mA -- -- ADP122AUJZ-3.3-R7CT-ND ADP1712 300mA 3.3V 3.5-5.5V 0.17V @ 300mA -- -- ADP1712AUJZ-3.3-R7TR-ND AP7311 (Low Cost) 150mA 3.3V 3.5-6V 0.15V @ 150mA -- -- AP7311-33WG-7DICT-ND LD39015M18R 150mA 1.8V 1.9V-5.5V 0.08V @ 100mA -- -- 497-6977-1-ND LP2985A-33DBVR 150mA 3.3V 3.3-16V 0.28V @ 150mA 206 150 296-18479-1-ND MCP1824T-3302E/OT 300mA 3.3V 3.5V-6V 0.2V @ 300mA -- -- MCP1824T-3302E/OTCT-ND MIC5205-2.5YM5 TR 150mA 2.5V 2.7-16V 0.165V @ 150mA -- -- 576-1257-2-ND MIC5205-3.0YM5 TR 150mA 3.0V 3.2V-16V 0.165V @ 150mA -- -- 576-1258-2-ND MIC5205-3.3YM5 TR 150mA 3.3V 3.5V-16V 0.165V @ 150mA -- -- 576-1259-2-ND TPS780330220 150mA 3.3V+2.2V 3.6-5.5V 250mV Max -- -- 296-23332-1-ND TDA3663/N1,135 100mA 3.3V 3.5-45V 0.18V @ 50mA -- -- 568-5343-1-ND Max operating temp can be calculated using θJA, TJ (max junction temperature), and power in watts. Set the "Maximum Ambient Temperature" until it reaches TJ ("Max Junction Temperature"), which is the absolute limit for safe use of the regulator: Heat Sink Temperature Calculator <http://www.daycounter.com/Calculators/Heat-Sink-Temperature-Calculator.phtml> For example, With 12V source into a 3.3V LP2985 and a 30mA load, we are dissipating (12V-3.3V) * 0.03A = 0.261W. With a θJA of 206 °C/W, a TJ of 150°C, and 261mW we can safely use the chip without a heat sink up to 75°C (=147.1°C Junction Temperature).
U3 = ubloxLib:MAX-M8: u-blox MAX GNSS module
U4 = SamacSys_Parts:AS179-92LF: SKYWORKS SOLUTIONS - AS179-92LF - IC, SWITCH, RF, SPDT, 0.02-3.0GHZ Source: Datasheet <http://www.skyworksinc.com/uploads/documents/AS179_92LF_200176H.pdf>; ARROW_PART_NUMBER: AS179-92LF; DESCRIPTION: SKYWORKS SOLUTIONS - AS179-92LF - IC, SWITCH, RF, SPDT, 0.02-3.0GHZ; HEIGHT: 1mm; MANUFACTURER_NAME: Skyworks; MANUFACTURER_PART_NUMBER: AS179-92LF
U5 = microbuilder:ATSAMD21J
X1 = adafruit2:XTAL: Low cost SMT crystals, no capacitors included http://www.ladyada.net/library/eagle

## Board
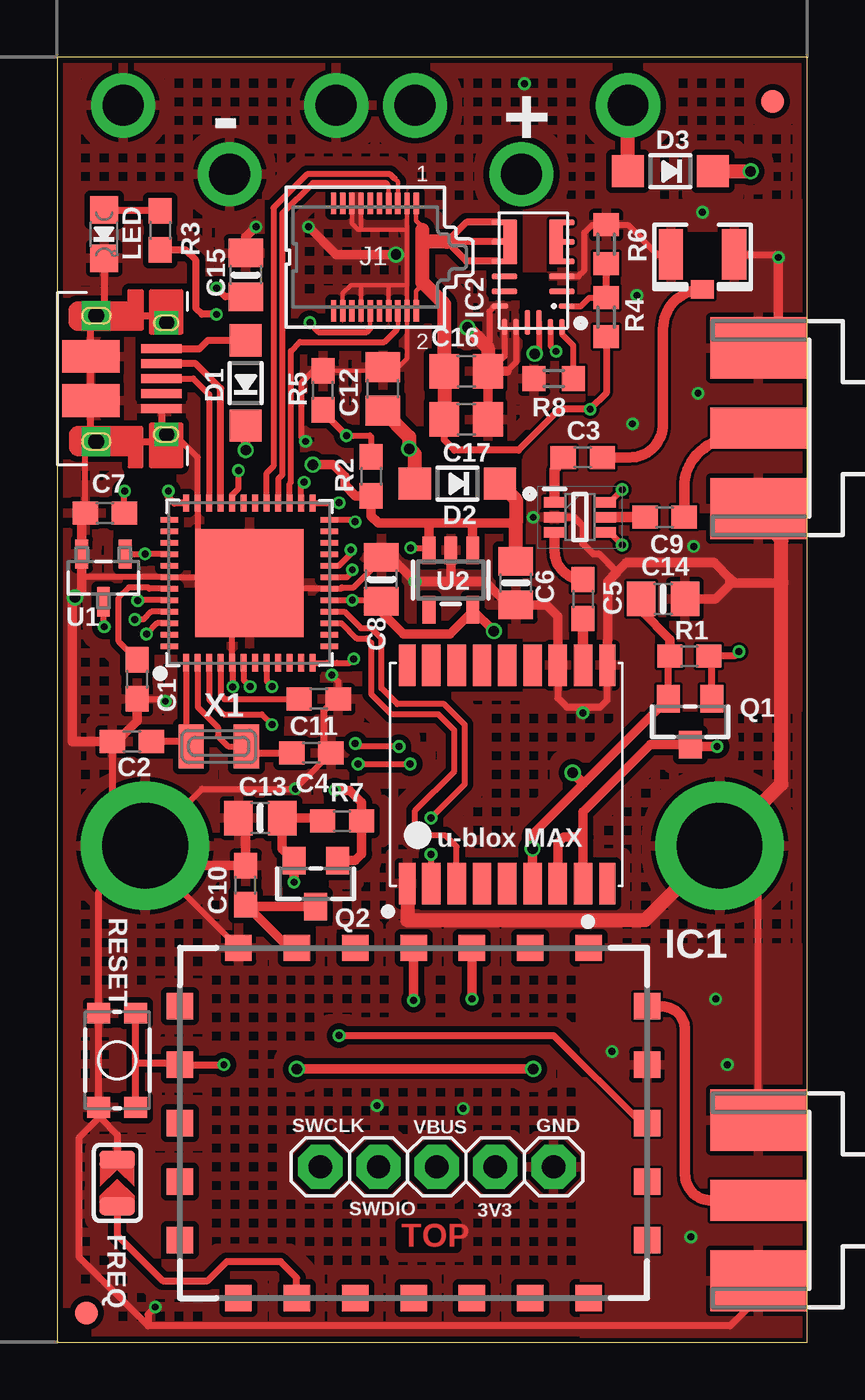
[diagram p5: board, top side]
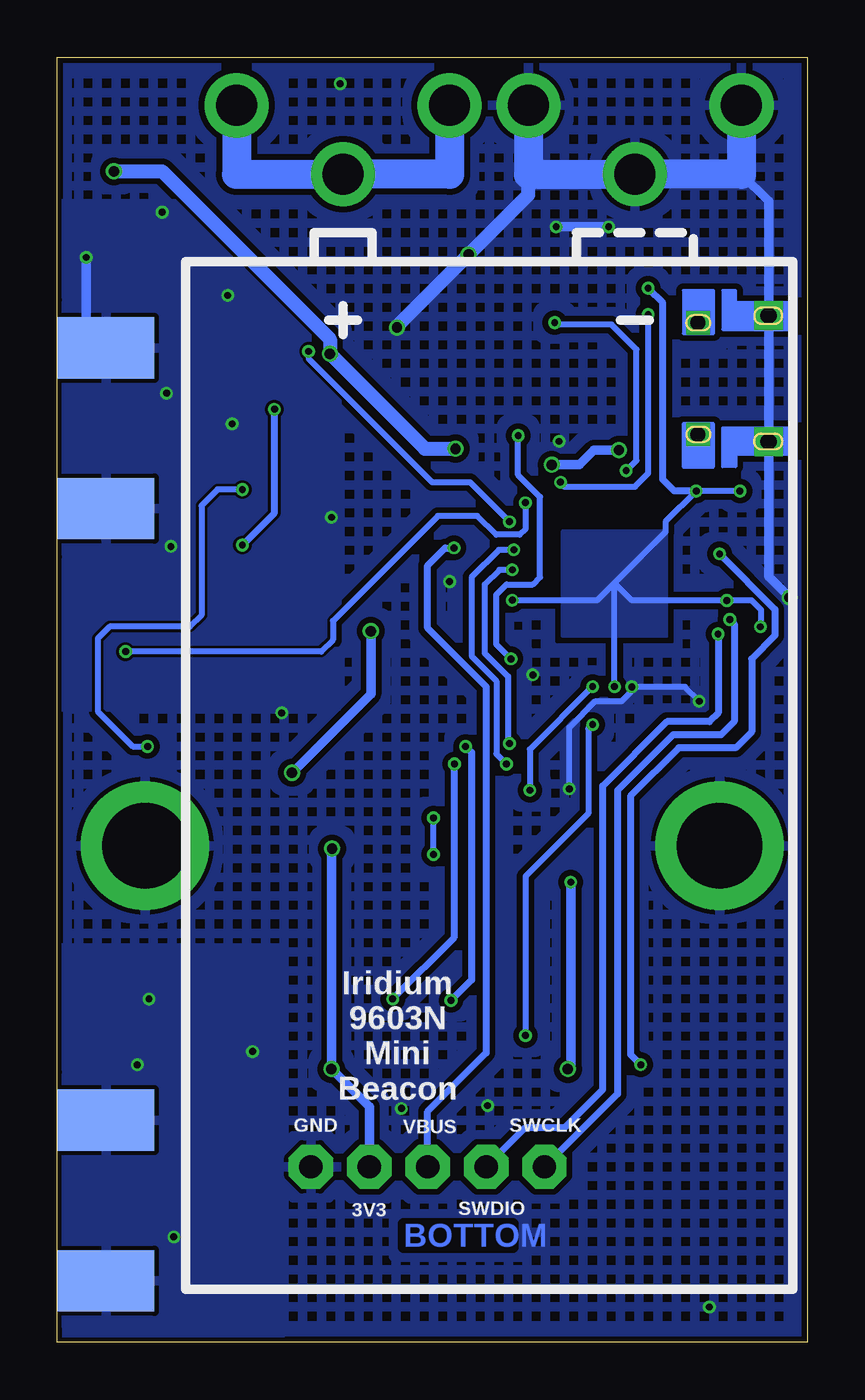
[diagram p6: board, bottom side, seen from below]

Size 32.62 x 55.88 mm. Coordinates in mm from the lower left corner, seen from the top.
Outline: 0,0 32.62,0 32.62,55.88 0,55.88 0,0
Copper layers (1*16): Top 0.018mm / dielectric 1.55mm / Bottom 0.018mm
Design rules "Multi-CB_2L_125um-Tracks_OL35um *": minimum track width 0.125mm, minimum drill 0.2mm, track to track 0.125mm, track to pad 0.125mm, pad to pad 0.125mm, via to via 0.125mm, smd to smd 0mil, copper to edge 0.2mm, drill to drill 0.2mm, minimum pad ring 0.125mm, minimum via ring 0.125mm, stop-mask expansion 2mil, vias tented up to drill 0.45mm, thermal gap 0.2mm

### Footprints (pad centres in the part's own frame; a part is rotated, then mirrored left to right if it is on the bottom)
1X01 = drill 1.016 pad 1.93 octagon: 1 0,0
J502-ND-142-0711-821/826 = smd 4.191 x 1.778: 1 2.115,0 | smd 4.191 x 2.667: G@1 2.115,3.495; G@2 2.115,-3.495 | smd 4.191 x 2.667 bottom: G@3 2.115,3.495; G@4 2.115,-3.495
BATTERY-9V-KEYSTONE-593-594-FLIPPED = drill 1.778 pad 2.794: GND 0,6.35; GND1 -2.997,10.986; GND2 -2.997,1.714; PWR 0,-6.35; PWR1 -2.997,-1.714; PWR2 -2.997,-10.986
0603-NO = smd 1.1 x 1: 1 -0.85,0; 2 0.85,0
0805-NO = smd 1.24 x 1.5: 1 -0.95,0; 2 0.95,0
C0805 = smd 1.3 x 1.5: 1 -0.95,0; 2 0.95,0
MICROBUILDER_FCI_10103594_CORRECTED = smd 1.425 x 2.5: BASE@1 -0.963,1.45; BASE@2 0.963,1.45 | smd 0.4 x 1.75: D+ 0,4.525; D- -0.65,4.525; GND 1.3,4.525; ID 0.65,4.525; VBUS -1.3,4.525 | drill 0.7 pad 1.25 square: SPRT@1 -2.736,1.679; SPRT@2 2.736,1.679 | drill 0.65 pad 1.016 square: SPRT@3 -2.426,4.747; SPRT@4 2.426,4.747
U.FL = smd 2.2 x 1.05: 1 0,1.375; 2 0,-1.375 | smd 0.8 x 1: 3 1.525,0
SOD-123 = smd 1.4 x 1.4: A 1.85,0; C -1.85,0
FIDUCIAL-1X2 = smd 1 x 1: 1 0,0
SOLDERJUMPER_ARROW_NOPASTE = smd 0.762 x 1.524: 1 -1.016,0; 2 1.016,0
ERIC4 = smd 1.15 x 1.15: 1 -7.62,-7.62; 2 -5.08,-7.62; 3 -2.54,-7.62; 4 0,-7.62; 5 2.54,-7.62; 6 5.08,-7.62; 7 7.62,-7.62; 8 10.16,-5.08; 9 10.16,-2.54; 10 10.16,0; 11 10.16,2.54; 12 10.16,5.08; 13 7.62,7.62; 14 5.08,7.62; 15 2.54,7.62; 16 0,7.62; 17 -2.54,7.62; 18 -5.08,7.62; 19 -7.62,7.62; 20 -10.16,5.08; 21 -10.16,2.54; 22 -10.16,0; 23 -10.16,-2.54; 24 -10.16,-5.08
QFN-20 = smd 0.7 x 0.25: 1 -1.45,1.55; 4 -1.45,-0.4; 5 -1.45,-1.25; 6 -1.45,-2.1; 7 1.45,-2.1; 8 1.45,-1.25; 9 1.45,-0.4; 12 1.45,1.55 | smd 1.1 x 0.25: 2 -1.25,0.9; 3 -1.25,0.25; 10 1.25,0.25; 11 1.25,0.9 | smd 0.25 x 0.7: 13 1.25,2.45; 14 0.75,2.45; 17 -0.75,2.45; 18 -1.25,2.45 | smd 0.25 x 1.1: 15 0.25,2.25; 16 -0.25,2.25 | smd 0.6 x 1.95: 19 -1,-1.25; 20 1,-1.25
SS4-10-3.50-X-D = smd 0.23 x 0.93: 1 1.8,2.335; 2 1.8,-2.335; 3 1.4,2.335; 4 1.4,-2.335; 5 1,2.335; 6 1,-2.335; 7 0.6,2.335; 8 0.6,-2.335; 9 0.2,2.335; 10 0.2,-2.335; 11 -0.2,2.335; 12 -0.2,-2.335; 13 -0.6,2.335; 14 -0.6,-2.335; 15 -1,2.335; 16 -1,-2.335; 17 -1.4,2.335; 18 -1.4,-2.335; 19 -1.8,2.335; 20 -1.8,-2.335
CHIPLED_0805_NOOUTLINE = smd 1.2 x 1.2: A 0,-1.05; C 0,1.05
SOT23-WIDE = smd 1 x 1.2: 1 -0.95,-1; 2 0.95,-1; 3 0,1
R0603 = smd 1 x 1.1: 1 -0.85,0; 2 0.85,0
STANDOFF-ELECTRICAL-MCMASTER-95117A411 = drill 3.734 pad 5.588: P1 0,0
TACTILE_SWITCH_SMD_4.6X2.8MM = smd 0.9 x 1: 1 -2.05,-0.8; 2 2.05,-0.8; 3 2.05,0.8; 4 -2.05,0.8
SOT95P237X112-3N = smd 0.559 x 1.27: 1 -0.94,-1.041; 2 0.94,-1.041; 3 0,1.041
SOT23-5 = smd 0.55 x 1.2: 1 -0.95,-1.3; 2 0,-1.3; 3 0.95,-1.3; 4 0.95,1.3; 5 -0.95,1.3
MAX-M8 = smd 1.8 x 0.7: 1_GND 4.95,-4.4; 9_RESET_N 4.95,4.3; 10_GND -4.55,4.3; 18_SAFEBOOT_N -4.55,-4.4 | smd 1.8 x 0.8: 2_TXD 4.95,-3.35; 3_RXD 4.95,-2.25; 4_TIMEPULSE 4.95,-1.15; 5_EXTINT 4.95,-0.05; 6_V_BCKP 4.95,1.05; 7_VCC_IO 4.95,2.15; 8_VCC 4.95,3.25; 11_RF_IN -4.55,3.25; 12_GND -4.55,2.15; 13_LNA_EN -4.55,1.05; 14_VCC_RF -4.55,-0.05; 15_V_ANT/RESERVED -4.55,-1.15; 16_SDA -4.55,-2.25; 17_SCL -4.55,-3.35
SOT65P220X100-6N = smd 0.95 x 0.45: 1 -1.1,0.65; 2 -1.1,0; 3 -1.1,-0.65; 4 1.1,-0.65; 5 1.1,0; 6 1.1,0.65
TQFN48_7MM = smd 0.25 x 0.75: 1 -2.75,-3.475; 2 -2.25,-3.475; 3 -1.75,-3.475; 4 -1.25,-3.475; 5 -0.75,-3.475; 6 -0.25,-3.475; 7 0.25,-3.475; 8 0.75,-3.475; 9 1.25,-3.475; 10 1.75,-3.475; 11 2.25,-3.475; 12 2.75,-3.475; 25 2.75,3.475; 26 2.25,3.475; 27 1.75,3.475; 28 1.25,3.475; 29 0.75,3.475; 30 0.25,3.475; 31 -0.25,3.475; 32 -0.75,3.475; 33 -1.25,3.475; 34 -1.75,3.475; 35 -2.25,3.475; 36 -2.75,3.475 | smd 0.75 x 0.25: 13 3.475,-2.75; 14 3.475,-2.25; 15 3.475,-1.75; 16 3.475,-1.25; 17 3.475,-0.75; 18 3.475,-0.25; 19 3.475,0.25; 20 3.475,0.75; 21 3.475,1.25; 22 3.475,1.75; 23 3.475,2.25; 24 3.475,2.75; 37 -3.475,2.75; 38 -3.475,2.25; 39 -3.475,1.75; 40 -3.475,1.25; 41 -3.475,0.75; 42 -3.475,0.25; 43 -3.475,-0.25; 44 -3.475,-0.75; 45 -3.475,-1.25; 46 -3.475,-1.75; 47 -3.475,-2.25; 48 -3.475,-2.75 | smd 4.7 x 4.7: THERMAL 0,0
XTAL3215 = smd 1.1 x 1.9: P$1 1.2,0; P$2 -1.2,0

### Placement (x,y rotation side)
3V3  19.05,7.62 0 top
ANTENNA  32.62,39.75 180 top
BAT  13.84,50.8 270 bottom
C1  3.46,28.83 270 top
C2  3.24,26.13 180 top
C3  22.86,38.48 0 top
C4  11.05,25.62 0 top
C5  22.86,32.32 270 top
C6  19.94,33.02 270 top
C7  2.06,36.07 180 top
C8  14.1,33.18 90 top
C9  26.42,35.88 180 top
C10  8.19,19.88 90 top
C11  11.37,27.97 0 top
C12  14.16,41.47 90 top
C13  8.83,22.8 180 top
C14  26.35,32.32 0 top
C15  8.19,46.42 90 top
C16  17.78,42.23 0 top
C17  17.78,40.13 0 top
CON1  0,41.91 270 top
CON2  28.07,47.31 270 top
D1  8.19,41.72 90 top
D2  17.4,37.34 180 top
D3  26.67,50.93 180 top
FD1  1.27,1.27 0 top
FD2  31.11,53.98 0 top
FREQ  2.6,6.92 90 top
GND  21.59,7.62 0 top
IC1  15.49,9.53 180 top
IC2  20.7,46.61 180 top
J1  13.81,47.19 0 top
LED  2.03,48.2 180 top
Q1  27.53,26.99 180 top
Q2  11.24,19.94 180 top
R1  27.5,29.84 180 top
R2  13.65,37.66 90 top
R3  4.48,48.36 90 top
R4  23.88,44.58 270 top
R5  11.56,41.4 90 top
R6  23.88,47.75 270 top
R7  12.38,22.67 180 top
R8  21.59,41.91 0 top
RADIO  32.62,6.16 180 top
S1  3.81,21.59 0 top
S2  28.81,21.59 0 top
SW1  2.6,12.26 90 top
SWCLK  11.43,7.62 0 top
SWDIO  13.97,7.62 0 top
U1  2,33.24 180 top
U2  17.11,33.15 180 top
U3  19.62,24.89 270 top
U4  22.73,35.88 0 top
U5  8.35,33.02 0 top
VBUS  16.51,7.62 0 top
X1  7.02,25.91 180 top

### Tracks (layer width: path | path; a pad name or v marks a point on that pad's centre or on a via)
3V3ERIC
  Top 0.406: Q2.3 8.28,18.94 C10.1 10.07,17.14 IC1.6
3V3SW  (via drill 0.3)
  Top 0.254: v24.57,37.08 24.02,36.53 U4.6 | 27.61,25.91 Q1.3
  Top 0.406: U3.8_VCC 22.87,21.97 | 22.87,21.97 22.87,23.06 25.8,25.99 Q1.3 | U3.7_VCC_IO 21.77,21.71 22.04,21.97 22.87,21.97 | v28.7,25.91 27.61,25.91
  Bottom 0.254: v24.57,37.08 25.65,37.08 26.35,36.39 26.35,31.62 26.86,31.12 30.35,31.12 30.86,30.61 30.86,27.43 29.34,25.91 v28.7,25.91
!RESET  (via drill 0.3)
  Top 0.254: U5.40 3.96,34.27 3.94,34.28 v3.81,34.28 U1.1
  Top 0.305: v7.24,12.07 IC1.9 5.27,12.13 3.4,12.13 | SW1.1 3.4,12.13 | 3.4,12.13 SW1.2
  Bottom 0.305: v3.81,34.28 1.4,31.87 1.4,30.73 2.41,29.72 2.41,26.54 3.11,25.84 5.59,25.84 7.68,23.75 7.68,12.51 v7.24,12.07
+3V3  (via drill 0.3, 0.45)
  Top 0.254: C8.1 14.06,32.27 v12.83,32.27 U5.17 | U5.44 3.5,32.27 v3.49,32.26 | U5.6 8.1,28.79 v8.38,28.51 | C7.1 v2.91,37.01 v2.92,37.02 | U1.3 2,31.15 v2.03,31.12
  Top 0.305: Q1.2 26.58,29.78 R1.2 | C15.1 7.3,45.47 v6.92,45.85 | U5.36 5.1,36.5 4.83,36.77 v4.83,37.02
  Top 0.406: U3.6_V_BCKP v20.67,21.46 20.67,22.08 22.89,24.3 | 22.89,24.3 Q1.2 | C8.1 14.1,31.75 15.05,30.8 17.08,30.8 18.06,31.78 U2.5 v18.99,30.93 | v18.99,30.93 | v22.42,24.77 22.89,24.3 | R1.2 26.64,30.57 25.4,31.81 C14.1 | v10.29,20 v10.29,20.01 Q2.2 9.78,21.45 C13.1 11.4,22.8 R7.2 | v20.7,11.88 v10.41,11.88
  Bottom 0.254: 8.38,33.02 7.62,32.26 v3.49,32.26 2.41,32.26 2,31.84 2,31.15 v2.03,31.12 | v8.38,28.51 8.38,33.02 | v12.83,32.27 9.13,32.27 8.38,33.02 | 8.38,33.02 6.16,35.24 6.16,35.69 v4.83,37.02 v2.92,37.02
  Bottom 0.305: v4.83,37.02 5.78,37.02 6.29,37.53 6.29,45.21 v6.92,45.85
  Bottom 0.406: v18.99,30.93 18.99,28.19 v22.42,24.77 | 3V3.1 19.05,10.22 v20.7,11.88 20.7,21.43 v20.67,21.46 | v10.29,20 10.29,12 v10.41,11.88
  pour Bottom: 6.1,35.27 10.67,35.27 10.67,30.7 6.1,30.7
+5V  (via drill 0.3)
  Top 0.203: 15.88,48.39 15.88,48.51 15.61,48.78 J1.1 | J1.2 15.61,45.71 15.94,46.04
  Top 0.254: U4.4 24.02,35.23 v24.57,34.67
  Top 0.305: C17.1 16.83,39.24 17.27,38.8 20.07,38.8 21.84,40.58 v23.18,40.58 23.88,41.28 R4.2 | IC2.7 17.79,48.71 16.94,47.86 | 16.94,47.86 IC2.8 IC2.20 | IC2.9 17.79,47.01 16.94,47.86
  Top 0.61: C17.1 C16.1 16.83,45.15 15.94,46.04 15.88,46.1 15.88,47.88 | 15.88,47.88 15.88,48.39 | 16.94,47.86 15.89,47.86 15.88,47.88
  Bottom 0.305: v24.57,34.67 23.18,36.07 v23.18,40.58
A0  (via drill 0.3)
  Top 0.254: U5.3 6.6,27.94 7.24,27.3 8.89,27.3 v9.34,26.86
  Top 0.305: v12.26,13.34 21.59,13.34 25.4,9.53 IC1.22
  Bottom 0.254: v9.34,26.86 9.53,26.67 9.53,22.99 12.26,20.26 v12.26,13.34
A2  (via drill 0.3)
  Top 0.254: U5.8 9.1,28.75 v9.34,28.51
  Top 0.406: Q2.1 12.94,20.94 13.23,21.23 R7.1 13.23,23.47 12.7,24 v12.06,24
  Bottom 0.254: v9.34,28.51 12.06,25.78 v12.06,24
ANTENNA
  Top 0.457: ANTENNA.1 30.5,39.24 arc90 30.44,39.31 29.4,39.31 arc90 27.27,37.17 C9.1
AREF
  Top 0.254: U5.4 7.1,28.14 7.27,27.97 C11.1
D0  (via drill 0.3)
  Top 0.254: U3.2_TXD 16.27,21.19 v16.26,21.21 | v16.26,22.8 17.72,24.26 17.72,26.86 16.83,27.75 14.8,27.75 14.1,28.45 14.1,30.61 13.65,31.05 13.21,31.05 12.49,31.77 U5.16
  Bottom 0.254: v16.26,21.21 v16.26,22.8
D1
  Top 0.254: U5.15 12.35,31.27 13.02,30.61 13.46,30.61 13.65,30.42 13.65,28.19 14.54,27.3 16.57,27.3 17.27,26.61 17.27,24.83 15.56,23.11 15.56,22.42 15.94,22.04 16.89,22.04 17.37,21.55 U3.3_RXD
D5  (via drill 0.3)
  Top 0.254: U5.24 12.87,35.77 v12.95,35.69 | IC2.17 21.45,43.34 v21.69,43.09
  Bottom 0.254: v12.95,35.69 14.67,37.4 16.32,37.4 21.69,42.78 v21.69,43.09
D6
  Top 0.203: J1.5 14.81,50.47 14.67,50.61
  Top 0.254: U5.29 9.1,37.8 9.4,38.1 9.4,49.34 10.86,50.8 14.48,50.8 14.67,50.61
D9  (via drill 0.3)
  Top 0.254: R2.2 13.65,39.37 13.59,39.43 v12.57,39.43 | v12.89,29.72 12.72,29.55 12.16,29.55 11.72,29.55 U5.12
  Top 0.305: R5.1 11.56,40.45 v12.57,39.43
  Bottom 0.254: v12.57,39.43 12.57,37.72 11.62,36.77 11.62,33.27 11.94,32.96 13.08,32.96 13.53,32.51 13.53,30.35 v12.89,29.72
D10
  Top 0.203: 14.73,44.01 14.81,44.08 J1.6
  Top 0.254: U5.27 10.1,37.34 10.16,37.4 10.16,43.12 10.54,43.5 14.22,43.5 14.73,44.01
D11  (via drill 0.3)
  Top 0.254: U5.25 12.24,36.5 v12.26,36.51
  Top 0.305: Q1.1 28.48,29.71 R1.1 29.46,29.84 v29.65,30.04
  Bottom 0.254: v12.26,36.51 12.26,35.37 12.51,35.12 13.53,35.12 14.35,35.94 16.07,35.94 20.64,31.37 20.64,30.54 21.14,30.04 v29.65,30.04
D12
  Top 0.203: J1.7 14.41,50.3 14.35,50.36
  Top 0.254: 14.35,50.36 14.29,50.42 11.11,50.42 9.78,49.09 9.78,37.72 9.6,37.54 U5.28
D13  (via drill 0.3)
  Top 0.254: U5.26 10.6,37.27 v10.73,37.4
  Top 0.305: R3.1 5.58,47.51 6.03,47.05 6.03,44.96 6.29,44.7 v6.92,44.7
  Bottom 0.254: v10.73,37.4 10.54,37.21 7.49,37.21 6.92,37.78 v6.92,44.7
D+
  Top 0.254: CON1.D+ 5.91,41.91 6.6,41.22 U5.34
D-
  Top 0.305: U5.33 7.1,41.48 6.02,42.56 CON1.D-
FREQ
  Top 0.305: FREQ.1 2.6,4.64 4.57,2.67 6.54,2.67 7.37,3.49 9.72,3.49 10.41,2.79 IC1.14
GND  (via drill 0.3, 0.45)
  Top 0.203: J1.3 15.21,48.39 | 15.21,48.39 15.21,47.31 | 15.21,47.31 15.21,45.97 | 15.21,45.97 J1.4 15.21,42.77 14.69,42.25 R5.2 | v14.73,47.31 15.21,47.31 | J1.18 12.41,45.62 12.76,45.97 13.21,45.97 | 13.21,45.97 14.41,45.97 | 14.41,45.97 15.21,45.97 | J1.14 13.21,45.97 | J1.8 14.41,45.97 | J1.15 12.81,48.66 13.08,48.39 13.21,48.39 | 13.21,48.39 15.21,48.39 | J1.13 13.21,48.39
  Top 0.254: U5.THERMAL 8.1,33.27 U5.42 1.06,33.27 | 8.27,32.94 7.6,32.27 U5.5 7.63,29.52 v7.63,28.5 | 8.27,32.94 U5.THERMAL | 8.27,32.94 8.44,32.77 U5.18 12.32,32.77 12.38,32.83 12.89,32.83 14.1,34.04 C8.2 | U5.THERMAL 6.1,35.27 U5.35 6.1,38.48 5.4,39.17 4.44,39.17 | v11.94,29.02 12.22,28.74 C11.2 | C7.2 1.21,38.71 CON1.SPRT@2 | C1.2 4.6,27.98 v4.7,27.88 | IC2.12 19.02,45.06 18.8,44.83 18.8,42.23 | C16.2 18.8,42.23 | IC2.13 19.45,42.88 18.8,42.23 | IC2.14 19.95,42.62 19.56,42.23 | IC2.3 22.67,46.36 22.92,46.61 22.92,48.26 23.27,48.6 R6.1 24.81,48.6 26.1,47.31 | R5.2 11.14,42.25 10.6,41.72 10.6,39.37 v10.79,39.18 | C4.2 v10.35,24.07 6.29,24.07 S1.P1 3.81,21.21 IC1.7
  Top 0.305: CON1.SPRT@1 1.45,44.42 CON1.BASE@1 CON1.BASE@2 1.45,39.4 CON1.SPRT@2 4.44,39.17 CON1.SPRT@4 4.53,39.71 CON1.GND | CON1.SPRT@1 4.44,44.65 CON1.SPRT@3 | U3.12_GND 21.77,28.01 22.16,27.62 22.86,27.62 | U3.10_GND 23.92,27.92 23.62,27.62 22.86,27.62 | C2.2 2.39,23.01 S1.P1 1.8,19.58 SW1.3 SW1.4 1.8,9.75 | LED.C 2.03,45 CON1.SPRT@1 | U4.2 22.48,35.88 22.86,35.5 22.86,34.73 23.3,34.29 23.56,34.29 24.35,33.5 | CON2.1 31.24,47.31 v31.37,47.18 | v22.86,27.37 22.86,27.62 | CON2.2 26.1,47.31 | C4.2 11.58,25.94 11.58,27.46 12.1,27.97 C11.2 | RADIO.G@1 30.5,1.93 29.27,0.7 3.94,0.7 | 3.94,0.7 0.95,3.68 0.95,8.9 1.8,9.75 | v4.25,1.52 3.94,1.21 3.94,0.7 | FREQ.2 2.6,9.02 1.83,9.79 1.8,9.75 | RADIO.G@2 30.5,19.9 S2.P1
  Top 0.406: C8.2 14.51,34.13 v15.56,33.08 17.08,33.08 | 17.08,33.08 18.61,33.08 19.62,32.07 C6.2 21.27,32.07 21.77,31.57 U3.12_GND | U2.2 17.11,33.12 17.08,33.08 | U3.10_GND 23.92,30.52 23.94,30.54 23.94,33.08 24.35,33.5 24.77,33.91 28.57,33.91 29.27,33.22 | v31.37,47.18 31.37,43.01 ANTENNA.G@2 | C7.2 1.06,35.92 U1.2 1.06,33.27 1.06,32.68 v0.76,32.39 0.64,32.26 0.64,26.13 C2.2 2.57,26.13 3.46,27.02 C1.2 | C14.2 28.63,32.32 29.27,32.96 29.27,33.22 | 19.56,42.23 C16.2 C17.2 | v14.73,47.31 12.13,47.31 v10.92,48.51 | 29.27,33.22 29.46,33.02 31.5,33.02 | S1.P1 4.67,20.73 C10.2 8.19,22.48 C13.2 | C15.2 8.19,48.07 v8.64,48.51
  Top 0.61: U3.1_GND 15.22,18.35 25.57,18.35 S2.P1 31.5,24.28 31.5,33.02 31.5,34.88 ANTENNA.G@3 | v17.84,44.13 18.73,43.25 C16.2
  Bottom 0.254: v4.7,27.88 5.32,28.5 v7.63,28.5 7.63,28.31 8.06,27.88 9.21,27.88 10.35,26.73 v10.35,24.07
  Bottom 0.406: ANTENNA.G@2 31.37,43.01 v31.37,47.18 | v0.76,32.39 1.68,33.3 CON1.SPRT@2 CON1.SPRT@1 1.68,49.62 2.86,50.8 | v10.92,48.51 v8.64,48.51
  Bottom 0.61: v17.84,44.13 17.84,44.2 v14.73,47.31 12.13,49.91 12.13,50.8
  Bottom 1.27: BAT.GND1 2.86,50.8 BAT.GND 12.13,50.8 BAT.GND2
  other vias: 28.07,49.15 20.7,35.88 25.02,39.94 27.88,41.28 27.69,34.61 25.21,45.53 24.13,12.64 27.56,4.57 29.15,12.07 17.65,10.16 13.91,10.29 28.64,14.92 20.32,54.74
  pour Bottom (isolate 0.254, rank 2, hatched): 0,0 0,55.88 32.62,55.88 32.62,0
  pour Top (isolate 0.254, rank 2, hatched): 0,0 0,55.88 32.62,55.88 32.62,0
  pour Top (isolate 0.102): 20.45,49.53 32.62,49.53 32.62,27.62 20.45,27.62
  pour Bottom (isolate 0.102): 20.45,49.53 32.62,49.53 32.62,27.62 20.45,27.62
  pour Top (isolate 0.102): 22.92,17.14 32.62,17.14 32.62,0 22.92,0
  pour Bottom (isolate 0.102): 22.92,17.14 32.62,17.14 32.62,0 22.92,0
GNSS
  Top 0.457: U3.11_RF_IN 22.87,31.46 arc90 C5.2
IRIDIUM
  Top 0.457: C3.2 24.89,38.48 arc90 26.35,39.94 26.35,44.07 arc-90 CON2.3
MOSI  (via drill 0.3)
  Top 0.254: U5.19 12.59,33.26 12.83,33.5 v12.83,33.59 | v14.86,25.91 13.08,25.91 v12.95,26.04
  Top 0.406: IC1.4 v15.49,14.86
  Bottom 0.254: v12.83,33.59 13.4,33.59 14.03,32.96 14.03,29.97 13.02,28.96 13.02,26.1 v12.95,26.04
  Bottom 0.305: v15.49,14.86 14.61,15.75 14.61,25.65 v14.86,25.91
N$1
  Top 0.457: C3.1 21.63,37.92 U4.1
N$2
  Top 0.457: U4.3 21.63,34.4 arc90 C5.1
N$3
  Top 0.305: LED.A 4.44,49.25 R3.2
N$4
  Top 0.457: C9.2 U4.5
N$5
  Top 0.254: U5.1 5.6,26.12 X1.P$1
  Top 0.305: X1.P$1 5.59,26.13 C2.1
N$7
  Top 0.254: U5.2 6.1,27.62 6.99,26.73 6.99,26.35 7.43,25.91 X1.P$2
  Top 0.305: X1.P$2 8.22,25.82 8.36,25.67 8.54,25.62 C4.1
N$8
  Top 0.61: D3.A BAT.PWR2
  Bottom 1.27: BAT.PWR1 15.56,50.8 BAT.PWR 24.83,50.8 BAT.PWR2
N$16
  Top 0.305: D1.A 6.54,43.57 6.18,43.21 CON1.VBUS
N$26
  Top 0.254: IC2.1 22.77,45.06 23.14,45.43 R4.1
  Top 0.305: R4.1 R6.2
N$29
  Top 0.254: IC2.18 21.95,43.84 22.44,43.35 R8.2
RF
  Top 0.457: IC1.24 26.29,14.61 arc-90 27.3,13.59 27.3,7.3 arc90 28.45,6.16 RADIO.1
SCK  (via drill 0.3)
  Top 0.254: U5.20 12.24,33.77 12.76,34.29 v12.76,34.46 | v13.08,25.15 v15.35,25.15
  Top 0.406: IC1.3 v18.03,14.92
  Bottom 0.254: v12.76,34.46 13.42,34.46 14.61,33.27 14.61,29.84 13.53,28.77 13.53,25.59 v13.08,25.15
  Bottom 0.305: v18.03,14.92 15.37,17.59 15.37,25.13 v15.35,25.15
SCL  (via drill 0.3)
  Top 0.203: 13.61,44.09 J1.12
  Top 0.254: U5.32 7.6,36.85 7.87,37.12 v7.87,37.91 | v10.99,44.34 10.99,44.3 11.35,43.94 13.46,43.94 13.61,44.09
  Bottom 0.254: v7.87,37.91 7.43,38.35 7.43,43.18 8.51,44.26 10.9,44.26 v10.99,44.34
SWCLK  (via drill 0.3)
  Top 0.254: U5.45 4.08,31.77 3.75,31.43 v3.37,31.43
  Bottom 0.305: v3.37,31.43 3.17,31.24 3.17,26.99 3.75,26.42 5.84,26.42 8.26,24 8.26,10.8 SWCLK.1
SWDIO  (via drill 0.3)
  Top 0.254: U5.46 4.35,31.27 v3.87,30.8
  Bottom 0.305: v3.87,30.8 3.87,27.37 4.25,26.99 6.1,26.99 8.89,24.19 8.89,10.99 10.54,9.34 12.26,9.34 SWDIO.1
VBAT  (via drill 0.45)
  Top 0.254: IC2.16 20.95,43.18 v20.77,42.99
  Top 0.61: C12.1 15.3,39.37 v15.3,38.86 15.55,38.62 D2.A | D3.C v30.16,50.93
  Bottom 0.61: v15.3,38.86 16.64,38.86 v20.77,42.99 20.77,43.62 28.07,50.93 v30.16,50.93
VBUS  (via drill 0.3, 0.45)
  Top 0.254: v15.37,34.54 16.07,34.54 U2.3
  Top 0.406: 16.19,35.62 13.97,35.62 13.65,35.94 R2.1 12.98,36.81 12.51,37.27 12.51,37.66 12,38.16 v11.11,38.16 | 16.19,35.62 18.1,35.62 | 18.1,35.62 19.94,35.62 | U2.3 16.16,35.59 16.19,35.62 | U2.1 18.06,35.59 18.1,35.62 | D1.C v8.19,38.8
  Top 0.61: C6.1 19.94,35.62 19.94,36.65 D2.C
  Bottom 0.305: v15.37,34.54 15.75,34.54 16.51,33.78 16.51,31.05 13.97,28.51 13.97,12.57 16.51,10.03 VBUS.1
  Bottom 0.406: v11.11,38.16 9.91,38.16 9.27,38.8 v8.19,38.8
VDDCORE1
  Top 0.254: U5.43 4,32.77 3.94,32.83 3.11,32.83 2.67,32.39 2.67,30.47 C1.1

### Text on the board
Top: TOP
Bottom: BOTTOM
tPlace: - | +
bPlace: Iridium / 9603N / Mini / Beacon
tNames: RESET
bNames: SWCLK | VBUS | GND | SWDIO | 3V3